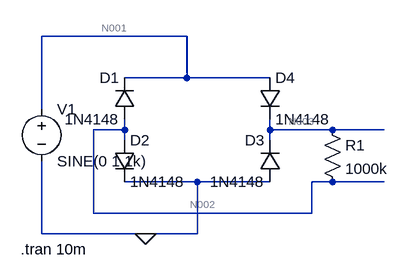
[diagram p0: schematic Draft7.asc]
Draft7.asc, the LTspice schematic file:
Version 4
SHEET 1 1716 680
WIRE 240 32 16 32
WIRE 240 96 240 32
WIRE 240 96 144 96
WIRE 368 96 240 96
WIRE 16 144 16 32
WIRE 144 176 144 160
WIRE 144 176 96 176
WIRE 368 176 368 160
WIRE 464 176 368 176
WIRE 544 176 464 176
WIRE 144 192 144 176
WIRE 368 192 368 176
WIRE 256 256 144 256
WIRE 368 256 256 256
WIRE 464 256 432 256
WIRE 544 256 464 256
WIRE 96 304 96 176
WIRE 432 304 432 256
WIRE 432 304 96 304
WIRE 16 336 16 224
WIRE 176 336 16 336
WIRE 256 336 256 256
WIRE 256 336 176 336
FLAG 176 336 0
SYMBOL diode 128 192 R0
SYMATTR InstName D2
SYMATTR Value 1N4148
SYMBOL diode 384 256 R180
WINDOW 0 24 64 Left 2
WINDOW 3 24 0 Left 2
SYMATTR InstName D3
SYMATTR Value 1N4148
SYMBOL voltage 16 128 R0
WINDOW 123 0 0 Left 0
WINDOW 39 0 0 Left 0
SYMATTR InstName V1
SYMATTR Value SINE(0 1 1k)
SYMBOL res 448 160 R0
SYMATTR InstName R1
SYMATTR Value 1000k
SYMBOL diode 352 96 R0
SYMATTR InstName D4
SYMATTR Value 1N4148
SYMBOL diode 160 160 R180
WINDOW 0 24 64 Left 2
WINDOW 3 24 0 Left 2
SYMATTR InstName D1
SYMATTR Value 1N4148
TEXT -16 360 Left 2 !.tran 10m

The netlist it stands for:
* Draft7.asc
D2 N002 0 1N4148
D3 0 N003 1N4148
V1 N001 0 SINE(0 1 1k)
R1 N003 N002 1000k
D4 N001 N003 1N4148
D1 N002 N001 1N4148
.model D D
.lib standard.dio
.tran 10m
.backanno
.end

* Results of the author's LTspice run, read from the files saved beside the schematic
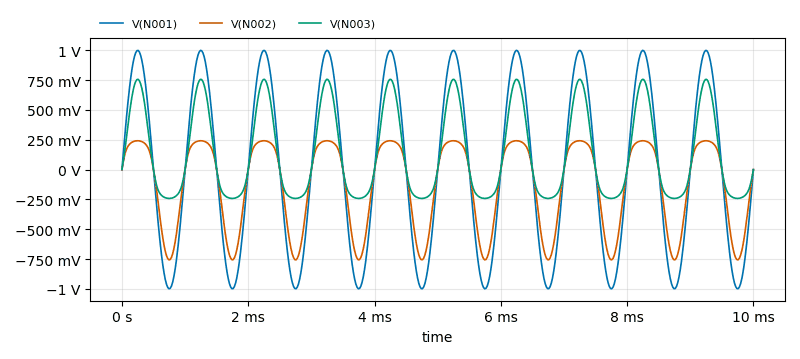
[diagram p1: Transient Analysis of Draft7.asc, plotted from the saved traces]
* Transient Analysis, 1 run:
*   V(N001): min -999.5 mV, max 999.5 mV, average -1.442 µV, rms 706.7 mV, last 0 V
*   V(N002): min -757 mV, max 241.6 mV, average -132.6 mV, rms 388.4 mV, last -107.5 µV
*   V(N003): min -241.6 mV, max 757 mV, average 132.6 mV, rms 388.4 mV, last 107.5 µV